# EAGLE design BreakoutTRRS (EAGLE 7.5.0)
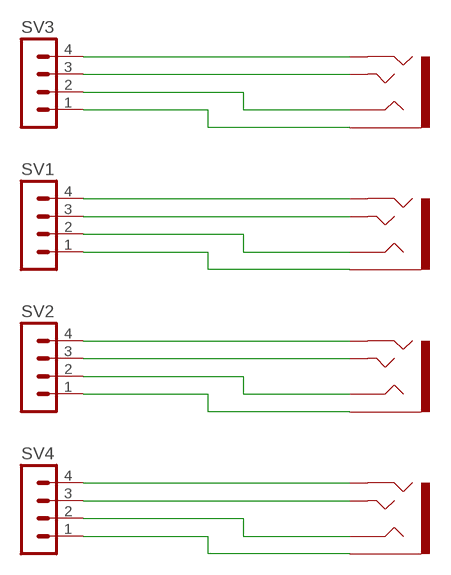
[diagram p0: schematic, sheet 1]

## Parts
SV1  MA04-1  [MA04-1]
SV2  MA04-1  [MA04-1]
SV3  MA04-1  [MA04-1]
SV4  MA04-1  [MA04-1]
TO-HEADSET1  AUDIO-JACK3  [AUDIO-JACK-TRRS-SMD]
TO-HEADSET2  AUDIO-JACK3  [AUDIO-JACK-TRRS-SMD]
TO-HEADSET3  AUDIO-JACK3  [AUDIO-JACK-TRRS-SMD]
TO-HEADSET4  AUDIO-JACK3  [AUDIO-JACK-TRRS-SMD]

## Nets
GND: SV2.4 TO-HEADSET1.RING2
GND1: SV1.4 TO-HEADSET2.RING2
GND2: SV3.4 TO-HEADSET3.RING2
GND3: SV4.4 TO-HEADSET4.RING2
N$1: SV1.1 TO-HEADSET2.EARTH
N$2: SV1.3 TO-HEADSET2.TIP
N$3: SV1.2 TO-HEADSET2.RING1
N$4: SV3.1 TO-HEADSET3.EARTH
N$5: SV3.3 TO-HEADSET3.TIP
N$6: SV3.2 TO-HEADSET3.RING1
N$7: SV2.1 TO-HEADSET1.EARTH
N$8: SV2.3 TO-HEADSET1.TIP
N$9: SV2.2 TO-HEADSET1.RING1
N$10: SV4.1 TO-HEADSET4.EARTH
N$11: SV4.3 TO-HEADSET4.TIP
N$12: SV4.2 TO-HEADSET4.RING1

## Library data of the parts
SV1-SV4 = con-lstb:MA04-1: PIN HEADER; OC_FARNELL: unknown; OC_NEWARK: unknown
TO-HEADSET1-TO-HEADSET4 = SparkFun-Connectors:AUDIO-JACK3: Audio jack - 3.5mm TRRS variety - two rings.

## Board
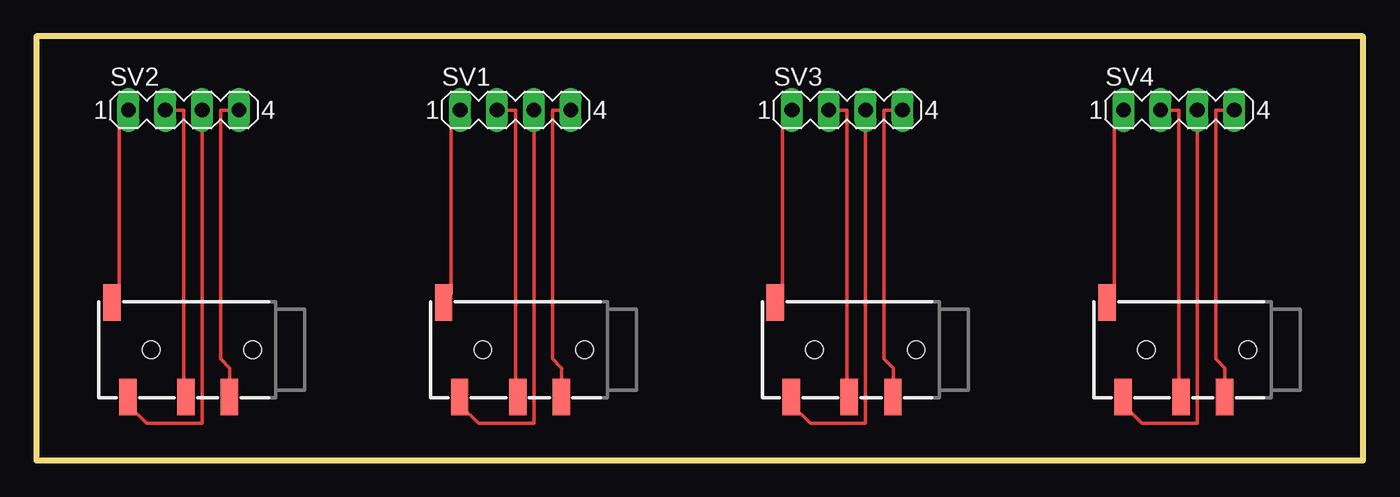
[diagram p1: board, top side]
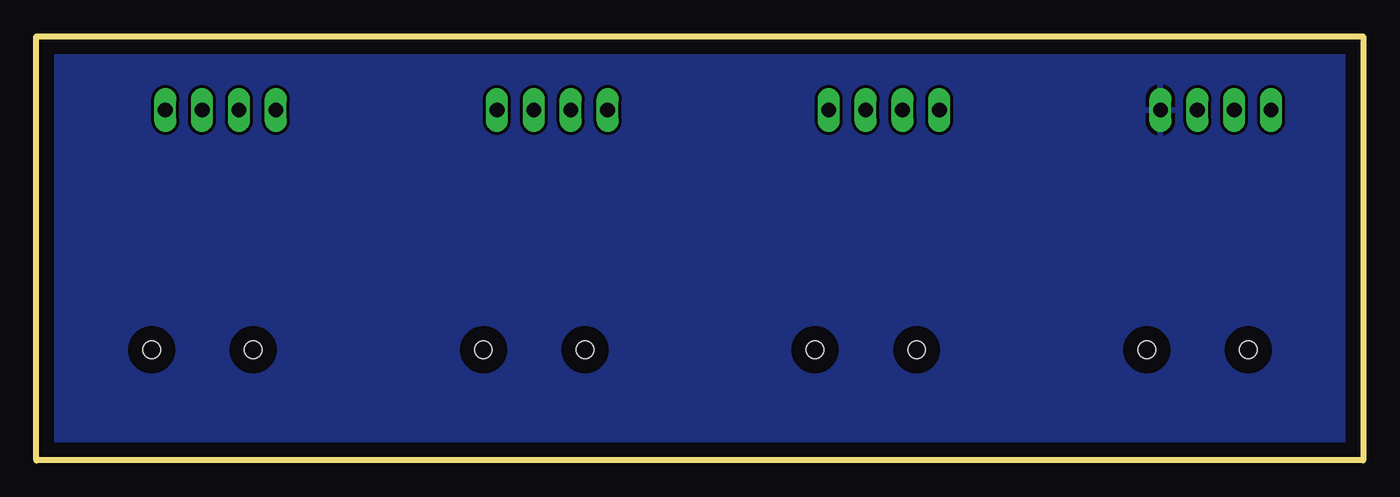
[diagram p2: board, bottom side, seen from below]

Size 91.44 x 29.21 mm. Coordinates in mm from the lower left corner, seen from the top.
Outline: 0,0 91.44,0 91.44,29.21 0,29.21 0,0
Copper layers (1*16): Top 0.035mm / dielectric 1.5mm / Bottom 0.035mm
Design rules "default": minimum track width 10mil, minimum drill 24mil, track to track 8mil, track to pad 8mil, pad to pad 8mil, via to via 8mil, smd to smd 8mil, copper to edge 40mil, drill to drill 8mil, minimum pad ring 10mil, minimum via ring 8mil, stop-mask expansion 4mil, vias tented up to drill 0mil, thermal gap 10mil

### Footprints (pad centres in the part's own frame; a part is rotated, then mirrored left to right if it is on the bottom)
MA04-1 = drill 1.016 long: 1 -3.81,0; 2 -1.27,0; 3 1.27,0; 4 3.81,0
AUDIO-JACK-TRRS-SMD = smd 1.2 x 2.5: EARTH 11.3,-3.25; RING1 6.2,3.25; RING2 3.2,3.25; TIP 10.2,3.25 | hole 1.2: 1.6,0; 8.6,0

### Placement (x,y rotation side)
SV1  33.02,24.13 0 top
SV2  10.16,24.13 0 top
SV3  55.88,24.13 0 top
SV4  78.74,24.13 0 top
TO-HEADSET1  16.51,7.62 180 top
TO-HEADSET2  39.37,7.62 180 top
TO-HEADSET3  62.23,7.62 180 top
TO-HEADSET4  85.09,7.62 180 top

### Tracks (layer width: path | path; a pad name or v marks a point on that pad's centre or on a via)
GND
  Top 0.254: SV2.4 12.7,24.13 12.7,6.99 13.34,6.35 13.34,4.45 TO-HEADSET1.RING2
  pour Bottom: 0,29.21 91.44,29.21 91.44,0 0,0
GND1
  Top 0.254: SV1.4 35.56,24.13 35.56,6.99 36.2,6.35 36.2,4.45 TO-HEADSET2.RING2
GND2
  Top 0.254: SV3.4 58.42,24.13 58.42,6.99 59.05,6.35 59.05,4.45 TO-HEADSET3.RING2
GND3
  Top 0.254: SV4.4 81.28,24.13 81.28,6.99 81.92,6.35 81.92,4.45 TO-HEADSET4.RING2
N$1
  Top 0.254: SV1.1 28.57,24.13 28.57,11.43 TO-HEADSET2.EARTH
N$2
  Top 0.254: SV1.3 34.29,2.54 30.48,2.54 29.21,3.81 TO-HEADSET2.TIP
N$3
  Top 0.254: SV1.2 33.02,24.13 33.02,4.45 TO-HEADSET2.RING1
N$4
  Top 0.254: SV3.1 51.44,24.13 51.44,11.43 TO-HEADSET3.EARTH
N$5
  Top 0.254: SV3.3 57.15,2.54 53.34,2.54 52.07,3.81 TO-HEADSET3.TIP
N$6
  Top 0.254: SV3.2 55.88,24.13 55.88,4.45 TO-HEADSET3.RING1
N$7
  Top 0.254: SV2.1 5.71,24.13 5.71,11.43 TO-HEADSET1.EARTH
N$8
  Top 0.254: SV2.3 11.43,2.54 7.62,2.54 6.35,3.81 TO-HEADSET1.TIP
N$9
  Top 0.254: SV2.2 10.16,24.13 10.16,4.45 TO-HEADSET1.RING1
N$10
  Top 0.254: SV4.1 74.3,24.13 74.3,11.43 TO-HEADSET4.EARTH
N$11
  Top 0.254: SV4.3 80.01,2.54 76.2,2.54 74.93,3.81 TO-HEADSET4.TIP
N$12
  Top 0.254: SV4.2 78.74,24.13 78.74,4.45 TO-HEADSET4.RING1